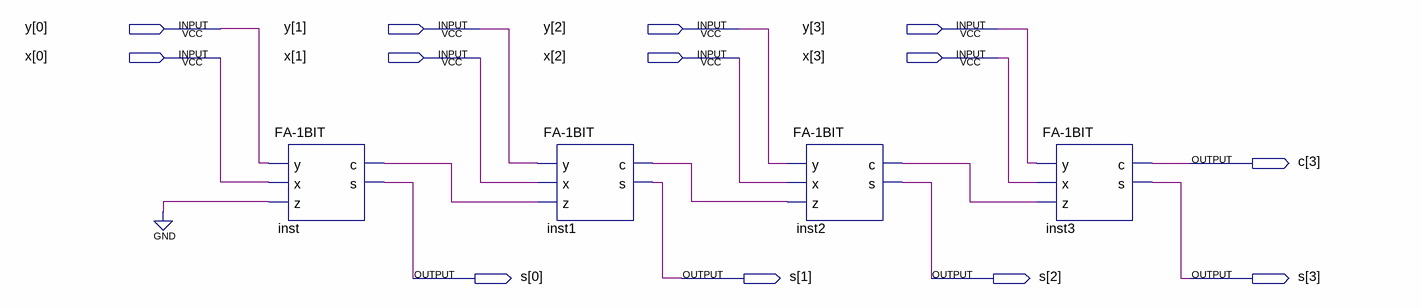
[diagram p0: schematic sheet]
// Quartus schematic FA-4BIT.bdf as structural Verilog: 4 symbols, 13 pins
module \FA-4BIT  (
  input  [3:0] y,
  input  [3:0] x,
  output [3:3] c,
  output [3:0] s
);

  wire inst1_c, inst2_c, inst_c;

  \FA-1BIT  inst (.y(y[0]), .x(x[0]), .z(1'b0), .c(inst_c), .s(s[0]));
  \FA-1BIT  inst1 (.y(y[1]), .x(x[1]), .z(inst_c), .c(inst1_c), .s(s[1]));
  \FA-1BIT  inst2 (.y(y[2]), .x(x[2]), .z(inst1_c), .c(inst2_c), .s(s[2]));
  \FA-1BIT  inst3 (.y(y[3]), .x(x[3]), .z(inst2_c), .c(c[3]), .s(s[3]));
endmodule
